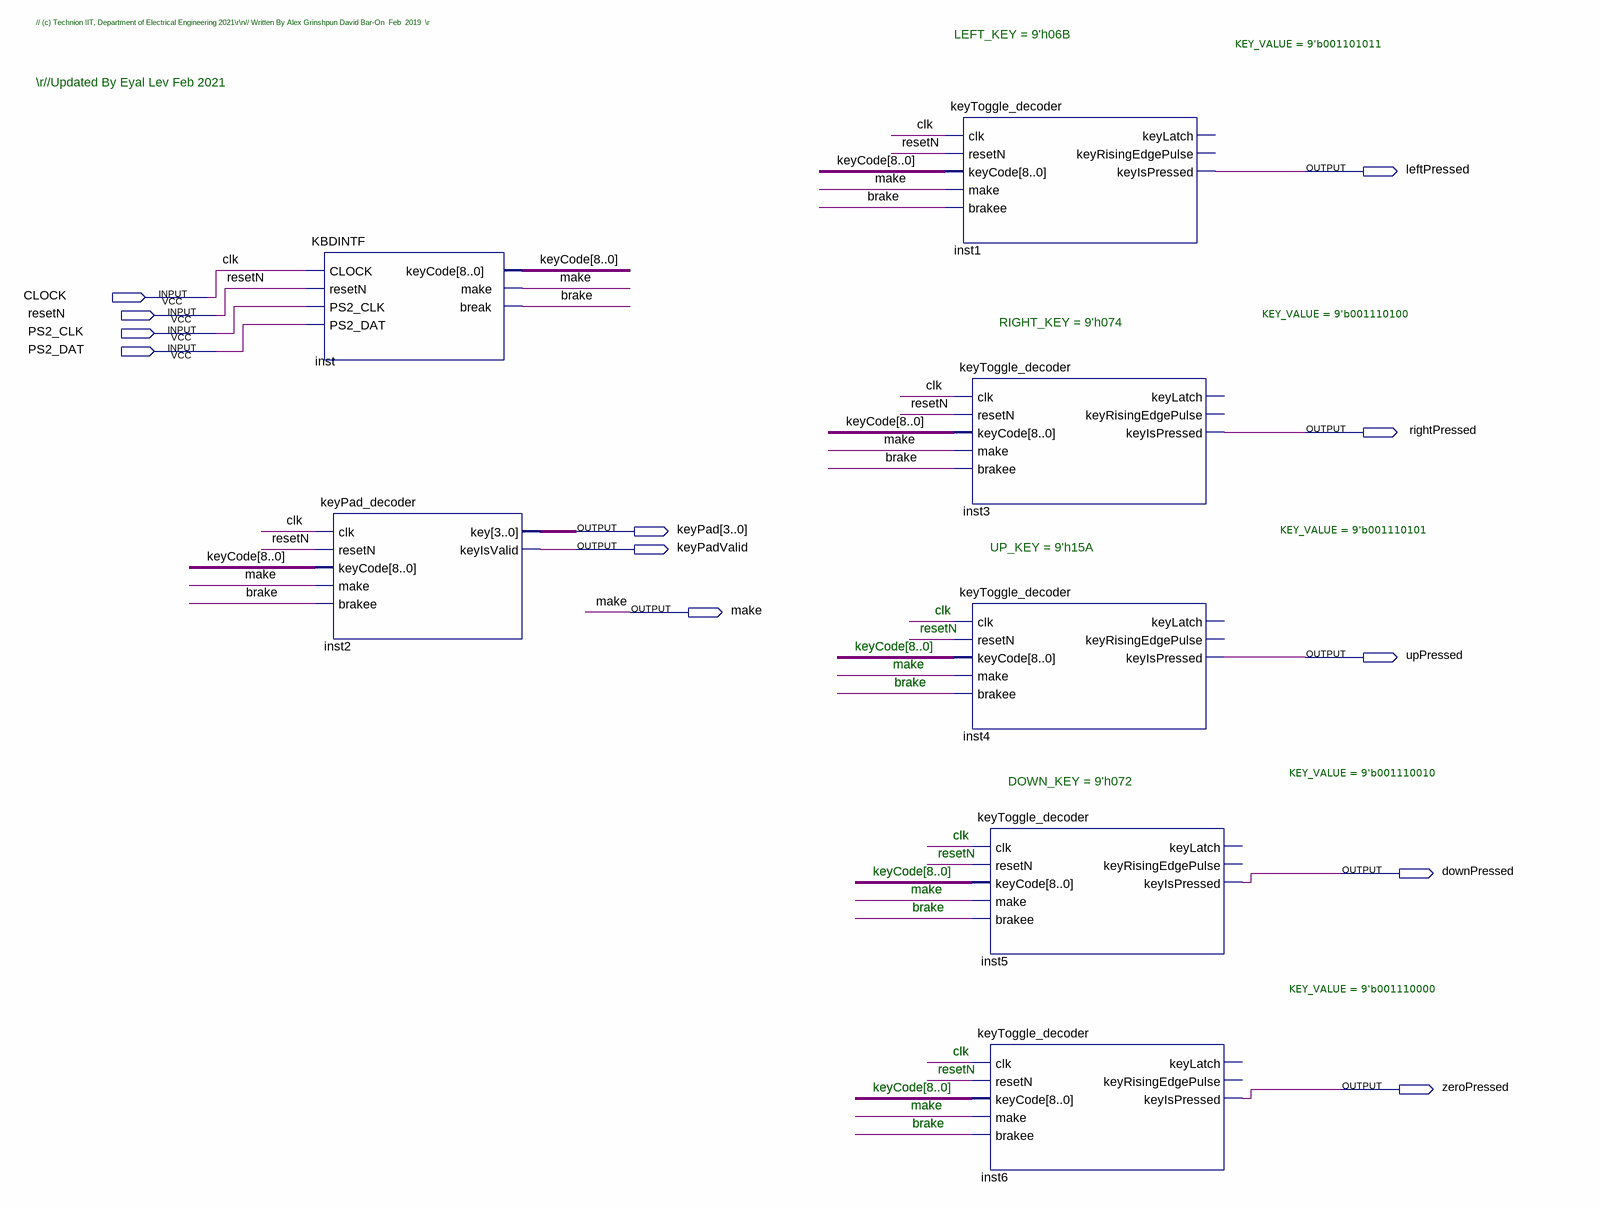
[diagram p0: schematic sheet]
// Quartus schematic KEYBOARD_INTERFACE.bdf as structural Verilog: 7 symbols, 12 pins
module KEYBOARD_INTERFACE (
  input  CLOCK,
  input  resetN,
  input  PS2_CLK,
  input  PS2_DAT,
  output leftPressed,
  output rightPressed,
  output [3:0] keyPad,
  output keyPadValid,
  output make,
  output upPressed,
  output downPressed,
  output zeroPressed
);

  wire brake;
  wire [8:0] keyCode;

  KBDINTF inst (
    .CLOCK(CLOCK), .resetN(resetN), .PS2_CLK(PS2_CLK), .PS2_DAT(PS2_DAT), .keyCode(keyCode), .make(make),
    .\break (brake));
  keyPad_decoder inst2 (
    .clk(CLOCK), .resetN(resetN), .keyCode(keyCode), .make(make), .brakee(brake), .key(keyPad),
    .keyIsValid(keyPadValid));
  keyToggle_decoder #(.KEY_VALUE(9'b001101011)) inst1 (
    .clk(CLOCK), .resetN(resetN), .keyCode(keyCode), .make(make), .brakee(brake), .keyIsPressed(leftPressed));  // open: keyLatch, keyRisingEdgePulse
  keyToggle_decoder #(.KEY_VALUE(9'b001110100)) inst3 (
    .clk(CLOCK), .resetN(resetN), .keyCode(keyCode), .make(make), .brakee(brake), .keyIsPressed(rightPressed));  // open: keyLatch, keyRisingEdgePulse
  keyToggle_decoder #(.KEY_VALUE(9'b001110101)) inst4 (
    .clk(CLOCK), .resetN(resetN), .keyCode(keyCode), .make(make), .brakee(brake), .keyIsPressed(upPressed));  // open: keyLatch, keyRisingEdgePulse
  keyToggle_decoder #(.KEY_VALUE(9'b001110010)) inst5 (
    .clk(CLOCK), .resetN(resetN), .keyCode(keyCode), .make(make), .brakee(brake), .keyIsPressed(downPressed));  // open: keyLatch, keyRisingEdgePulse
  keyToggle_decoder #(.KEY_VALUE(9'b001110000)) inst6 (
    .clk(CLOCK), .resetN(resetN), .keyCode(keyCode), .make(make), .brakee(brake), .keyIsPressed(zeroPressed));  // open: keyLatch, keyRisingEdgePulse

  // Other names for the same wires on the sheet: clk = CLOCK

  // Notes on the sheet:
  //   // (c) Technion IIT, Department of Electrical Engineering 2021\r\n// Written By Alex Grinshpun David Bar-On  Feb  2019  \r
  //   LEFT_KEY = 9'h06B 
  //   \r//Updated By Eyal Lev Feb 2021
  //   RIGHT_KEY = 9'h074
  //   UP_KEY = 9'h15A
  //   clk
  //   resetN
  //   keyCode[8..0]
  //   make
  //   brake
  //   DOWN_KEY = 9'h072
  //   clk
  //   resetN
  //   keyCode[8..0]
  //   make
  //   brake
  //   clk
  //   resetN
  //   keyCode[8..0]
  //   make
  //   brake
endmodule
